# Altium schematic sheet UD3.1.SchDoc
size A4; DocumentNumber: 1; SheetNumber: 1; SheetTotal: 7
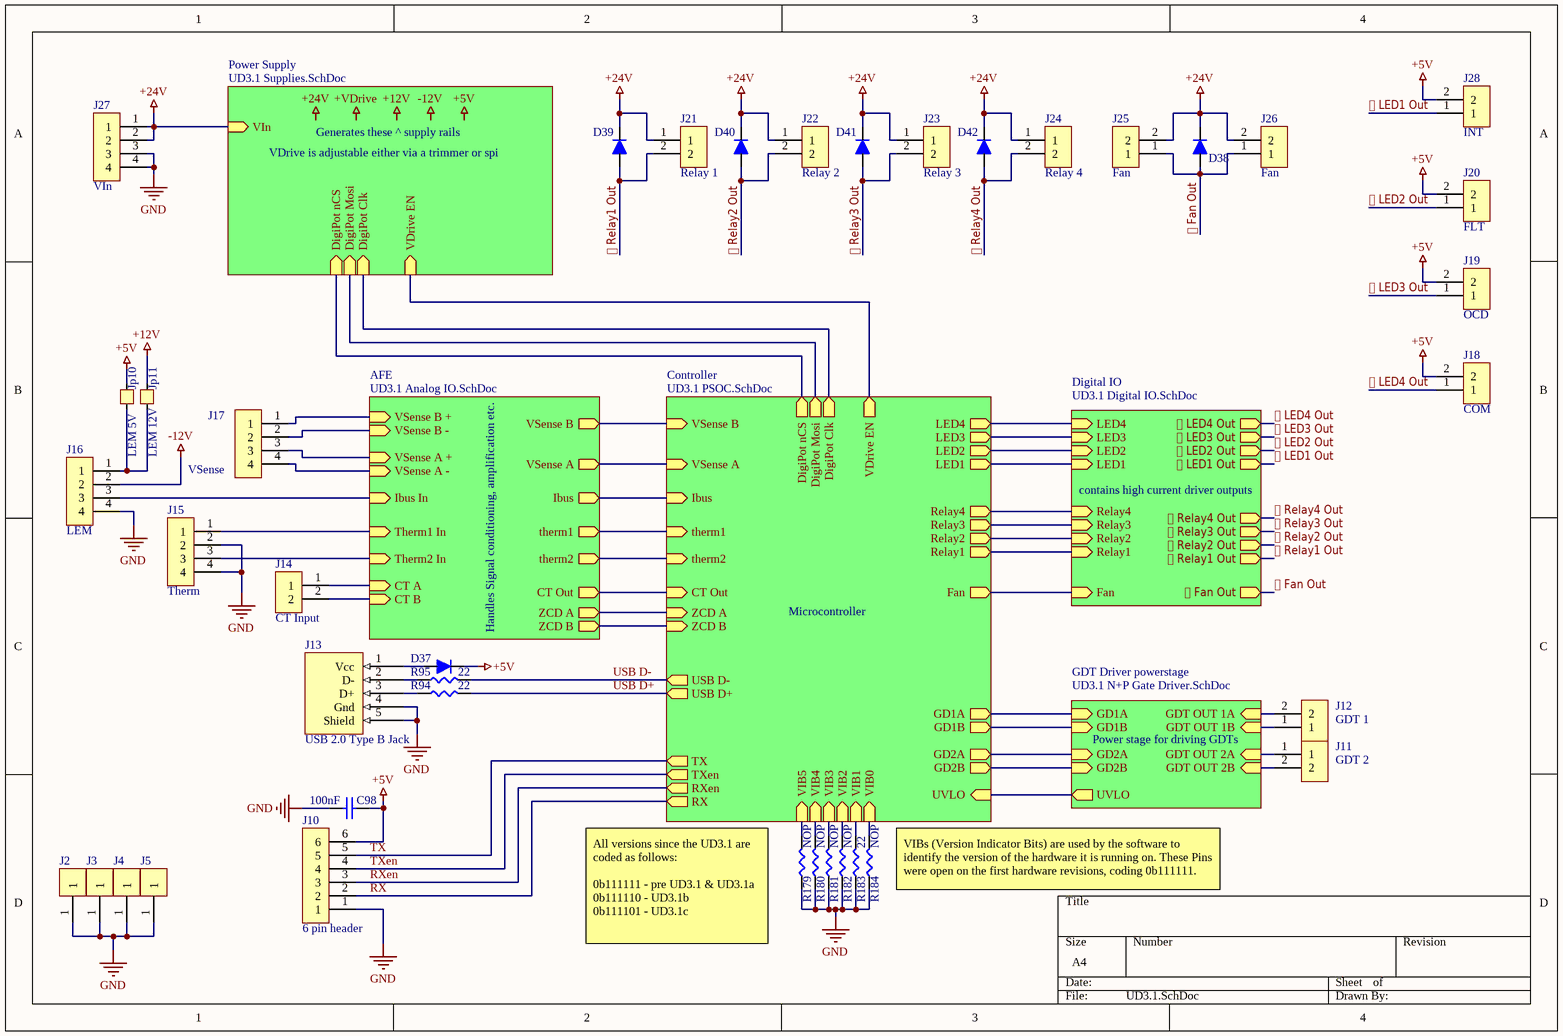
[diagram p0: UD3.1.SchDoc]

## Parts
C98  100nF  [0603]
D37  Schottky 30V 1A  [DO-214]  (value not drawn)
D38  Schottky 30V 1A  [DO-214]  (value not drawn)
D39  Schottky 30V 100mA  [SOD523]  (value not drawn)
D40  Schottky 30V 100mA  [SOD523]  (value not drawn)
D41  Schottky 30V 100mA  [SOD523]  (value not drawn)
D42  Schottky 30V 100mA  [SOD523]  (value not drawn)
J2  GND Pad  [1 Pad M3]  (value not drawn)
J3  GND Pad  [1 Pad M3]  (value not drawn)
J4  GND Pad  [1 Pad M3]  (value not drawn)
J5  GND Pad  [1 Pad M3]  (value not drawn)
J10  6 pin header  [6 KK254 / KF2510]
J11  GDT 2  [2 KK254 / KF2510]
J12  GDT 1  [2 KK254 / KF2510]
J13  USB 2.0 Type B Jack  [USB 2.0 Type B Vertical]
J14  CT Input  [2 KK254 / KF2510]
J15  Therm  [4 KK254 / KF2510]
J16  LEM  [4 KK254 / KF2510]
J17  VSense  [4 KK254 / KF2510]
J18  COM  [2 KK254 / KF2510]
J19  OCD  [2 KK254 / KF2510]
J20  FLT  [2 KK254 / KF2510]
J21  Relay 1  [2 KK254 / KF2510]
J22  Relay 2  [2 KK254 / KF2510]
J23  Relay 3  [2 KK254 / KF2510]
J24  Relay 4  [2 KK254 / KF2510]
J25  Fan  [2 KK254 / KF2510]
J26  Fan  [2 screw terminal vertical]
J27  VIn  [4 KK254 / KF2510]
J28  INT  [2 KK254 / KF2510]
Jp10  LEM 5V  [PCB Jumper NO]
Jp11  LEM 12V  [PCB Jumper NO]
R94  22  [0603]
R95  22  [0603]
R179  NOP  [0603]
R180  NOP  [0603]
R181  NOP  [0603]
R182  NOP  [0603]
R183  22  [0603]
R184  NOP  [0603]

## Sub-sheets
AFE = UD3.1 Analog IO.SchDoc: VSense B + (in), VSense B - (in), VSense A + (in), VSense A - (in), CT A (in), CT B (in), ZCD A (out), ZCD B (out), CT Out (out), Ibus In (in), Ibus (out), Therm1 In (in), therm1 (out), Therm2 In (in), therm2 (out), VSense A (out), VSense B (out)
Controller = UD3.1 PSOC.SchDoc: LED4 (out), LED1 (out), LED2 (out), LED3 (out), Relay1 (out), Relay3 (out), Relay2 (out), Relay4 (out), Fan (out), ZCD A (in), ZCD B (in), CT Out (in), Ibus (in), therm1 (in), therm2 (in), VSense A (in), VSense B (in), DigiPot nCS (out), DigiPot Mosi (out), DigiPot Clk (out), VDrive EN (out), GD1A (out), GD1B (out), GD2A (out), GD2B (out), UVLO (in), USB D- (out), USB D+ (out), RX (out), RXen (out), TXen (out), TX (out), VIB0 (in), VIB1 (in), VIB2 (in), VIB3 (in), VIB4 (in), VIB5 (in)
Digital IO = UD3.1 Digital IO.SchDoc: LED4 (in), ⎐ LED4 Out (out), LED1 (in), LED2 (in), LED3 (in), ⎐ LED3 Out (out), ⎐ LED2 Out (out), ⎐ LED1 Out (out), ⎐ Relay3 Out (out), Relay1 (in), Relay2 (in), Relay3 (in), Relay4 (in), ⎐ Relay1 Out (out), ⎐ Relay2 Out (out), ⎐ Relay4 Out (out), Fan (in), ⎐ Fan Out (out)
GDT Driver powerstage = UD3.1 N+P Gate Driver.SchDoc: GD1A (in), GD1B (in), GD2A (in), GD2B (in), GDT OUT 1A (in), GDT OUT 1B (in), GDT OUT 2A (in), GDT OUT 2B (in), UVLO (out)
Power Supply = UD3.1 Supplies.SchDoc: VIn (in), DigiPot nCS (in), DigiPot Mosi (in), DigiPot Clk (in), VDrive EN (in)

## Nets
+5V: C98.1 D37.2 J10.6 J18.2 J19.2 J20.2 J28.2 Jp10.2
+12V: Jp11.2
+24V: D38.2 D39.2 D40.2 D41.2 D42.2 J21.1 J22.1 J23.1 J24.1 J25.2 J26.2 J27.1 J27.2 ; sheet Power Supply/VIn
-12V: J16.2
GND: C98.2 J2.1 J3.1 J4.1 J5.1 J10.1 J13.4(Gnd) J13.5(Shield) J15.2 J15.4 J16.4 J27.3 J27.4 R179.2 R180.2 R181.2 R182.2 R183.2 R184.2
RX: J10.2 ; sheet Controller/RX
RXen: J10.3 ; sheet Controller/RXen
TX: J10.5 ; sheet Controller/TX
TXen: J10.4 ; sheet Controller/TXen
USB D+: R94.1 ; sheet Controller/USB D+
USB D-: R95.1 ; sheet Controller/USB D-
⎐ Fan Out: D38.1 J25.1 J26.1 ; sheet Digital IO/⎐ Fan Out
⎐ LED1 Out: J28.1 ; sheet Digital IO/⎐ LED1 Out
⎐ LED2 Out: J20.1 ; sheet Digital IO/⎐ LED2 Out
⎐ LED3 Out: J19.1 ; sheet Digital IO/⎐ LED3 Out
⎐ LED4 Out: J18.1 ; sheet Digital IO/⎐ LED4 Out
⎐ Relay1 Out: D39.1 J21.2 ; sheet Digital IO/⎐ Relay1 Out
⎐ Relay2 Out: D40.1 J22.2 ; sheet Digital IO/⎐ Relay2 Out
⎐ Relay3 Out: D41.1 J23.2 ; sheet Digital IO/⎐ Relay3 Out
⎐ Relay4 Out: D42.1 J24.2 ; sheet Digital IO/⎐ Relay4 Out
NetD37_1: D37.1 J13.1(Vcc)
NetJ11_1: J11.1 ; sheet GDT Driver powerstage/GDT OUT 2A
NetJ11_2: J11.2 ; sheet GDT Driver powerstage/GDT OUT 2B
NetJ12_1: J12.1 ; sheet GDT Driver powerstage/GDT OUT 1B
NetJ12_2: J12.2 ; sheet GDT Driver powerstage/GDT OUT 1A
NetJ13_2: J13.2(D-) R95.2
NetJ13_3: J13.3(D+) R94.2
NetJ14_1: J14.1 ; sheet AFE/CT A
NetJ14_2: J14.2 ; sheet AFE/CT B
NetJ15_1: J15.1 ; sheet AFE/Therm1 In
NetJ15_3: J15.3 ; sheet AFE/Therm2 In
NetJ16_1: J16.1 Jp10.1 Jp11.1
NetJ16_3: J16.3 ; sheet AFE/Ibus In
NetJ17_1: J17.1 ; sheet AFE/VSense B +
NetJ17_2: J17.2 ; sheet AFE/VSense B -
NetJ17_3: J17.3 ; sheet AFE/VSense A +
NetJ17_4: J17.4 ; sheet AFE/VSense A -
NetR179_1: R179.1 ; sheet Controller/VIB5
NetR180_1: R180.1 ; sheet Controller/VIB4
NetR181_1: R181.1 ; sheet Controller/VIB3
NetR182_1: R182.1 ; sheet Controller/VIB2
NetR183_1: R183.1 ; sheet Controller/VIB1
NetR184_1: R184.1 ; sheet Controller/VIB0
(unnamed): sheet Power Supply/DigiPot nCS, sheet Controller/DigiPot nCS
(unnamed): sheet Power Supply/DigiPot Mosi, sheet Controller/DigiPot Mosi
(unnamed): sheet Power Supply/DigiPot Clk, sheet Controller/DigiPot Clk
(unnamed): sheet Power Supply/VDrive EN, sheet Controller/VDrive EN
(unnamed): sheet Controller/LED4, sheet Digital IO/LED4
(unnamed): sheet Controller/LED1, sheet Digital IO/LED1
(unnamed): sheet Controller/LED2, sheet Digital IO/LED2
(unnamed): sheet Controller/LED3, sheet Digital IO/LED3
(unnamed): sheet Controller/Relay1, sheet Digital IO/Relay1
(unnamed): sheet Controller/Relay3, sheet Digital IO/Relay3
(unnamed): sheet Controller/Relay2, sheet Digital IO/Relay2
(unnamed): sheet Controller/Relay4, sheet Digital IO/Relay4
(unnamed): sheet Controller/Fan, sheet Digital IO/Fan
(unnamed): sheet Controller/ZCD A, sheet AFE/ZCD A
(unnamed): sheet Controller/ZCD B, sheet AFE/ZCD B
(unnamed): sheet Controller/CT Out, sheet AFE/CT Out
(unnamed): sheet Controller/Ibus, sheet AFE/Ibus
(unnamed): sheet Controller/therm1, sheet AFE/therm1
(unnamed): sheet Controller/therm2, sheet AFE/therm2
(unnamed): sheet Controller/VSense A, sheet AFE/VSense A
(unnamed): sheet Controller/VSense B, sheet AFE/VSense B
(unnamed): sheet Controller/GD1A, sheet GDT Driver powerstage/GD1A
(unnamed): sheet Controller/GD1B, sheet GDT Driver powerstage/GD1B
(unnamed): sheet Controller/GD2A, sheet GDT Driver powerstage/GD2A
(unnamed): sheet Controller/GD2B, sheet GDT Driver powerstage/GD2B
(unnamed): sheet Controller/UVLO, sheet GDT Driver powerstage/UVLO

## Notes on the sheet
- VDrive is adjustable either via a trimmer or spi
- Generates these ^ supply rails
- contains high current driver outputs
- Handles Signal conditioning, amplification etc.
- Microcontroller
- Power stage for driving GDTs
- VIBs (Version Indicator Bits) are used by the software to identify the version of the hardware it is running on. These Pins were open on the first hardware revisions, coding 0b111111.
- All versions since the UD3.1 are coded as follows:
  0b111111 - pre UD3.1 & UD3.1a
  0b111110 - UD3.1b
  0b111101 - UD3.1c
- Labels drawn without touching a wire or pin: +5V, +12V, +24V, +VDrive, -12V

## Library data of the parts
C98 = Cap
D37-D42 = Diode: Cmon its a diode what more do I need to say?; pin to pad: 1>2 2>1; Supplier 1: Digi-Key; Supplier Part Number 1: MBR10100GOS-ND; Supplier 2: Digi-Key; Supplier Part Number 2: 1655-1504-1-ND
J2-J5 = 1 Header
J10 = 6 header
J11 J12 J14 J18-J25 J28 = 2 header
J13 = USB 2.0 Type B
J15-J17 J27 = 4 header
J26 = 2 screw terminal
Jp10 Jp11 = Jumper
R94 R95 R179-R184 = Resistor